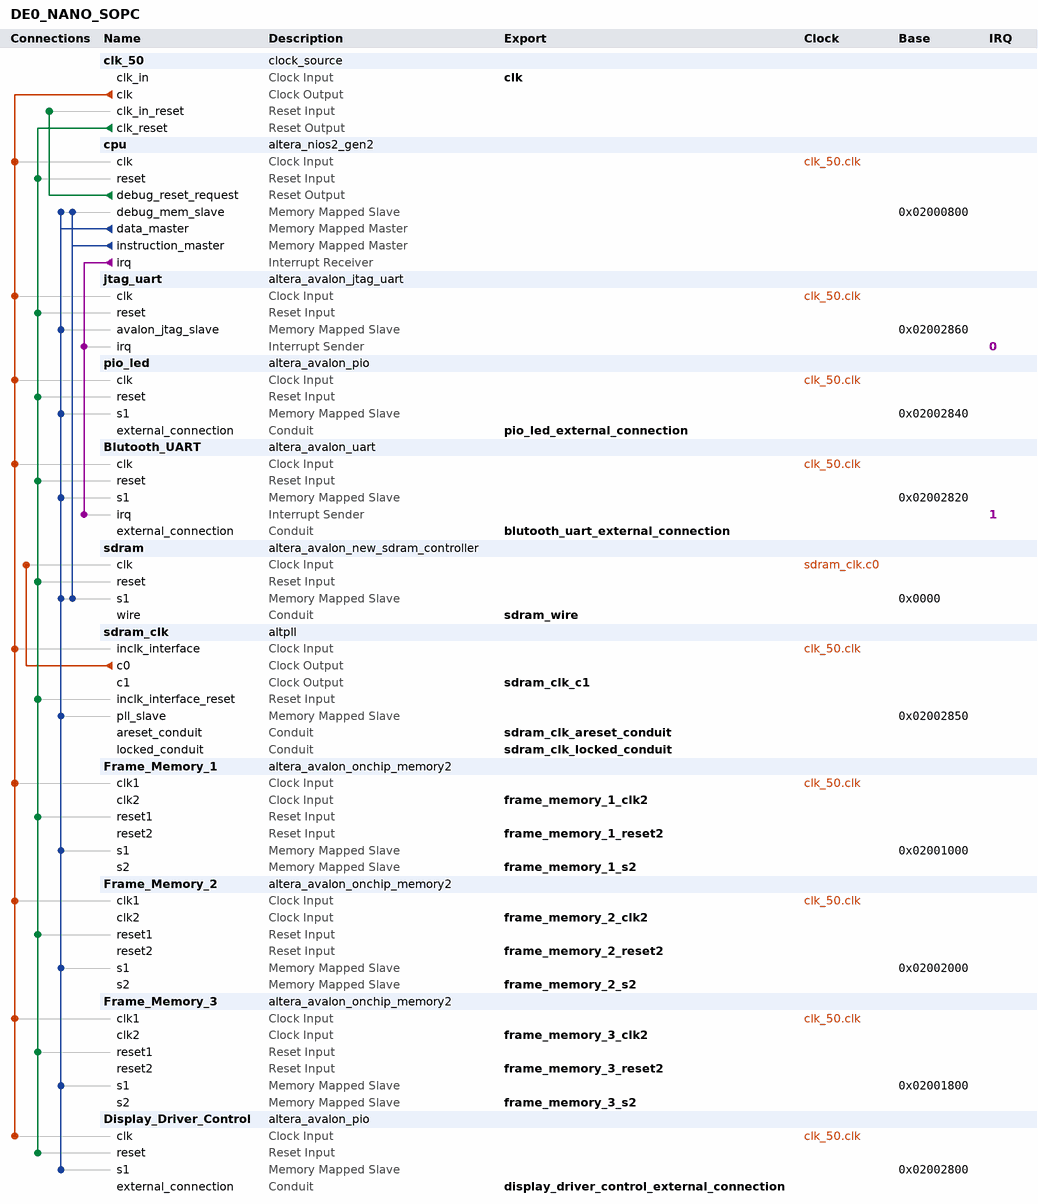
[diagram p0: system contents]
# Platform Designer (Qsys) system DE0_NANO_SOPC, Cyclone IV E EP4CE22F17C6
# Parameters at their usual value, and those the tool derives, are not listed.
package require -exact qsys 18.0
create_system DE0_NANO_SOPC
set_project_property DEVICE_FAMILY {Cyclone IV E}
set_project_property DEVICE EP4CE22F17C6

add_instance clk_50 clock_source 18.0
set_instance_parameter_value clk_50 clockFrequency 50000000

add_instance cpu altera_nios2_gen2 18.0
set_instance_parameter_value cpu dcache_size 2048
set_instance_parameter_value cpu exceptionSlave sdram.s1
set_instance_parameter_value cpu icache_size 4096
set_instance_parameter_value cpu impl Tiny
set_instance_parameter_value cpu resetSlave sdram.s1

add_instance jtag_uart altera_avalon_jtag_uart 18.0
set_instance_parameter_value jtag_uart simInteractiveOptions NO_INTERACTIVE_WINDOWS

add_instance pio_led altera_avalon_pio 18.0
set_instance_parameter_value pio_led direction Output
set_instance_parameter_value pio_led width 8

add_instance Blutooth_UART altera_avalon_uart 18.0
set_instance_parameter_value Blutooth_UART baud 38400
set_instance_parameter_value Blutooth_UART dataBits 8
set_instance_parameter_value Blutooth_UART fixedBaud true
set_instance_parameter_value Blutooth_UART parity NONE
set_instance_parameter_value Blutooth_UART stopBits 1

add_instance sdram altera_avalon_new_sdram_controller 18.0
set_instance_parameter_value sdram TAC 5.5
set_instance_parameter_value sdram TRCD 20.0
set_instance_parameter_value sdram TRP 20.0
set_instance_parameter_value sdram casLatency 3
set_instance_parameter_value sdram columnWidth 9
set_instance_parameter_value sdram dataWidth 16
set_instance_parameter_value sdram generateSimulationModel false
set_instance_parameter_value sdram model single_Micron_MT48LC4M32B2_7_chip
set_instance_parameter_value sdram numberOfBanks 4
set_instance_parameter_value sdram numberOfChipSelects 1
set_instance_parameter_value sdram powerUpDelay 100.0
set_instance_parameter_value sdram refreshPeriod 15.625
set_instance_parameter_value sdram rowWidth 13

add_instance sdram_clk altpll 18.0
set_instance_parameter_value sdram_clk CLK0_DIVIDE_BY 1
set_instance_parameter_value sdram_clk CLK0_MULTIPLY_BY 2
set_instance_parameter_value sdram_clk CLK1_DIVIDE_BY 1
set_instance_parameter_value sdram_clk CLK1_DUTY_CYCLE 50
set_instance_parameter_value sdram_clk CLK1_MULTIPLY_BY 2
set_instance_parameter_value sdram_clk CLK1_PHASE_SHIFT -1667
set_instance_parameter_value sdram_clk INCLK0_INPUT_FREQUENCY 20000
set_instance_parameter_value sdram_clk PORT_ARESET PORT_USED
set_instance_parameter_value sdram_clk PORT_LOCKED PORT_USED
set_instance_parameter_value sdram_clk PORT_clk1 PORT_USED
set_instance_parameter_value sdram_clk PORT_clk2 PORT_UNUSED
set_instance_parameter_value sdram_clk PORT_clk3 PORT_UNUSED

add_instance Frame_Memory_1 altera_avalon_onchip_memory2 18.0
set_instance_parameter_value Frame_Memory_1 dataWidth 32
set_instance_parameter_value Frame_Memory_1 dualPort true
set_instance_parameter_value Frame_Memory_1 initMemContent true
set_instance_parameter_value Frame_Memory_1 initializationFileName onchip_mem.hex
set_instance_parameter_value Frame_Memory_1 memorySize 1536

add_instance Frame_Memory_2 altera_avalon_onchip_memory2 18.0
set_instance_parameter_value Frame_Memory_2 dataWidth 32
set_instance_parameter_value Frame_Memory_2 dualPort true
set_instance_parameter_value Frame_Memory_2 initMemContent true
set_instance_parameter_value Frame_Memory_2 initializationFileName onchip_mem.hex
set_instance_parameter_value Frame_Memory_2 memorySize 1536

add_instance Frame_Memory_3 altera_avalon_onchip_memory2 18.0
set_instance_parameter_value Frame_Memory_3 dataWidth 32
set_instance_parameter_value Frame_Memory_3 dualPort true
set_instance_parameter_value Frame_Memory_3 initMemContent true
set_instance_parameter_value Frame_Memory_3 initializationFileName onchip_mem.hex
set_instance_parameter_value Frame_Memory_3 memorySize 1536

add_instance Display_Driver_Control altera_avalon_pio 18.0
set_instance_parameter_value Display_Driver_Control bitModifyingOutReg true
set_instance_parameter_value Display_Driver_Control direction InOut
set_instance_parameter_value Display_Driver_Control width 8

# connections
add_connection clk_50.clk Blutooth_UART.clk clock
add_connection clk_50.clk cpu.clk clock
add_connection clk_50.clk Display_Driver_Control.clk clock
add_connection clk_50.clk Frame_Memory_1.clk1 clock
add_connection clk_50.clk Frame_Memory_2.clk1 clock
add_connection clk_50.clk Frame_Memory_3.clk1 clock
add_connection clk_50.clk jtag_uart.clk clock
add_connection clk_50.clk pio_led.clk clock
add_connection clk_50.clk sdram_clk.inclk_interface clock
add_connection sdram_clk.c0 sdram.clk clock
add_connection clk_50.clk_reset Blutooth_UART.reset reset
add_connection clk_50.clk_reset cpu.reset reset
add_connection clk_50.clk_reset Display_Driver_Control.reset reset
add_connection clk_50.clk_reset Frame_Memory_1.reset1 reset
add_connection clk_50.clk_reset Frame_Memory_2.reset1 reset
add_connection clk_50.clk_reset Frame_Memory_3.reset1 reset
add_connection clk_50.clk_reset jtag_uart.reset reset
add_connection clk_50.clk_reset pio_led.reset reset
add_connection clk_50.clk_reset sdram.reset reset
add_connection clk_50.clk_reset sdram_clk.inclk_interface_reset reset
add_connection cpu.debug_reset_request clk_50.clk_in_reset reset
add_connection cpu.data_master Blutooth_UART.s1 avalon
set_connection_parameter_value cpu.data_master/Blutooth_UART.s1 baseAddress 0x02002820
add_connection cpu.data_master cpu.debug_mem_slave avalon
set_connection_parameter_value cpu.data_master/cpu.debug_mem_slave baseAddress 0x02000800
add_connection cpu.data_master Display_Driver_Control.s1 avalon
set_connection_parameter_value cpu.data_master/Display_Driver_Control.s1 baseAddress 0x02002800
add_connection cpu.data_master Frame_Memory_1.s1 avalon
set_connection_parameter_value cpu.data_master/Frame_Memory_1.s1 baseAddress 0x02001000
add_connection cpu.data_master Frame_Memory_2.s1 avalon
set_connection_parameter_value cpu.data_master/Frame_Memory_2.s1 baseAddress 0x02002000
add_connection cpu.data_master Frame_Memory_3.s1 avalon
set_connection_parameter_value cpu.data_master/Frame_Memory_3.s1 baseAddress 0x02001800
add_connection cpu.data_master jtag_uart.avalon_jtag_slave avalon
set_connection_parameter_value cpu.data_master/jtag_uart.avalon_jtag_slave baseAddress 0x02002860
add_connection cpu.data_master pio_led.s1 avalon
set_connection_parameter_value cpu.data_master/pio_led.s1 baseAddress 0x02002840
add_connection cpu.data_master sdram.s1 avalon
set_connection_parameter_value cpu.data_master/sdram.s1 baseAddress 0x0000
add_connection cpu.data_master sdram_clk.pll_slave avalon
set_connection_parameter_value cpu.data_master/sdram_clk.pll_slave baseAddress 0x02002850
add_connection cpu.instruction_master cpu.debug_mem_slave avalon
set_connection_parameter_value cpu.instruction_master/cpu.debug_mem_slave baseAddress 0x02000800
add_connection cpu.instruction_master sdram.s1 avalon
set_connection_parameter_value cpu.instruction_master/sdram.s1 baseAddress 0x0000
add_connection cpu.irq Blutooth_UART.irq interrupt
set_connection_parameter_value cpu.irq/Blutooth_UART.irq irqNumber 1
add_connection cpu.irq jtag_uart.irq interrupt
set_connection_parameter_value cpu.irq/jtag_uart.irq irqNumber 0

# exported interfaces
add_interface blutooth_uart_external_connection conduit end
set_interface_property blutooth_uart_external_connection EXPORT_OF Blutooth_UART.external_connection
add_interface clk clock sink
set_interface_property clk EXPORT_OF clk_50.clk_in
add_interface display_driver_control_external_connection conduit end
set_interface_property display_driver_control_external_connection EXPORT_OF Display_Driver_Control.external_connection
add_interface frame_memory_1_clk2 clock sink
set_interface_property frame_memory_1_clk2 EXPORT_OF Frame_Memory_1.clk2
add_interface frame_memory_1_reset2 reset sink
set_interface_property frame_memory_1_reset2 EXPORT_OF Frame_Memory_1.reset2
add_interface frame_memory_1_s2 avalon slave
set_interface_property frame_memory_1_s2 EXPORT_OF Frame_Memory_1.s2
add_interface frame_memory_2_clk2 clock sink
set_interface_property frame_memory_2_clk2 EXPORT_OF Frame_Memory_2.clk2
add_interface frame_memory_2_reset2 reset sink
set_interface_property frame_memory_2_reset2 EXPORT_OF Frame_Memory_2.reset2
add_interface frame_memory_2_s2 avalon slave
set_interface_property frame_memory_2_s2 EXPORT_OF Frame_Memory_2.s2
add_interface frame_memory_3_clk2 clock sink
set_interface_property frame_memory_3_clk2 EXPORT_OF Frame_Memory_3.clk2
add_interface frame_memory_3_reset2 reset sink
set_interface_property frame_memory_3_reset2 EXPORT_OF Frame_Memory_3.reset2
add_interface frame_memory_3_s2 avalon slave
set_interface_property frame_memory_3_s2 EXPORT_OF Frame_Memory_3.s2
add_interface pio_led_external_connection conduit end
set_interface_property pio_led_external_connection EXPORT_OF pio_led.external_connection
add_interface sdram_clk_areset_conduit conduit end
set_interface_property sdram_clk_areset_conduit EXPORT_OF sdram_clk.areset_conduit
add_interface sdram_clk_c1 clock source
set_interface_property sdram_clk_c1 EXPORT_OF sdram_clk.c1
add_interface sdram_clk_locked_conduit conduit end
set_interface_property sdram_clk_locked_conduit EXPORT_OF sdram_clk.locked_conduit
add_interface sdram_wire conduit end
set_interface_property sdram_wire EXPORT_OF sdram.wire

set_interconnect_requirement {$system} qsys_mm.clockCrossingAdapter HANDSHAKE
set_interconnect_requirement {$system} qsys_mm.enableEccProtection FALSE
set_interconnect_requirement {$system} qsys_mm.insertDefaultSlave FALSE
set_interconnect_requirement {$system} qsys_mm.maxAdditionalLatency 1

save_system DE0_NANO_SOPC.qsys
